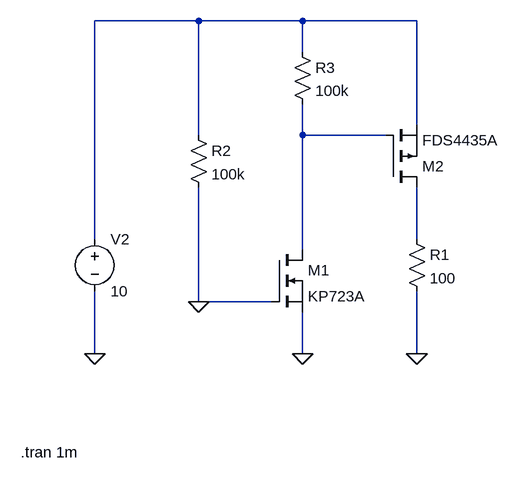
[diagram p0: schematic pmos_enable.asc]
pmos_enable.asc, the LTspice schematic file:
Version 4
SHEET 1 1172 680
WIRE -608 -704 -768 -704
WIRE -448 -704 -608 -704
WIRE -272 -704 -448 -704
WIRE -448 -656 -448 -704
WIRE -272 -544 -272 -704
WIRE -608 -528 -608 -704
WIRE -448 -528 -448 -576
WIRE -320 -528 -448 -528
WIRE -768 -368 -768 -704
WIRE -272 -368 -272 -448
WIRE -448 -352 -448 -528
WIRE -608 -272 -608 -448
WIRE -496 -272 -608 -272
WIRE -768 -192 -768 -288
WIRE -448 -192 -448 -256
WIRE -272 -192 -272 -288
FLAG -768 -192 0
FLAG -448 -192 0
FLAG -272 -192 0
FLAG -608 -272 0
SYMBOL voltage -768 -384 R0
WINDOW 123 0 0 Left 0
WINDOW 39 0 0 Left 0
SYMATTR InstName V2
SYMATTR Value 10
SYMBOL nmos -496 -352 R0
SYMATTR InstName M1
SYMATTR Value KP723A
SYMBOL res -624 -544 R0
SYMATTR InstName R2
SYMATTR Value 100k
SYMBOL pmos -320 -448 M180
SYMATTR InstName M2
SYMATTR Value FDS4435A
SYMBOL res -464 -672 R0
SYMATTR InstName R3
SYMATTR Value 100k
SYMBOL res -288 -384 R0
SYMATTR InstName R1
SYMATTR Value 100
TEXT -882 -40 Left 2 !.tran 1m

The netlist it stands for:
* pmos_enable.asc
V2 N001 0 10
M1 N002 0 0 0 KP723A
R2 N001 0 100k
M2 N003 N002 N001 N001 FDS4435A
R3 N001 N002 100k
R1 N003 0 100
.model NMOS NMOS
.model PMOS PMOS
.lib standard.mos
.tran 1m
.backanno
.end